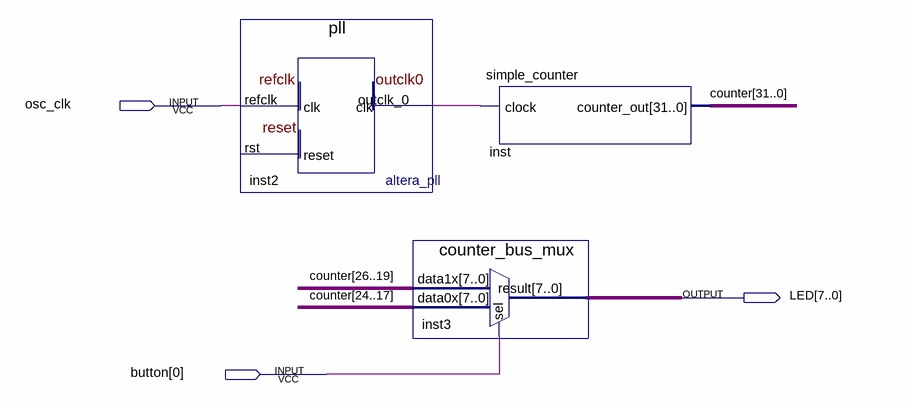
[diagram p0: schematic sheet]
// Quartus schematic my_first_fpga_top.bdf as structural Verilog: 3 symbols, 3 pins
module my_first_fpga_top (
  input  osc_clk,
  input  [0:0] button,
  output [7:0] LED
);

  wire inst2_outclk_0;
  wire [31:0] counter;

  pll inst2 (.refclk(osc_clk), .outclk_0(inst2_outclk_0));  // open: rst
  counter_bus_mux inst3 (.data1x(counter[26:19]), .data0x(counter[24:17]), .sel(button[0]), .result(LED));
  simple_counter inst (.clock(inst2_outclk_0), .counter_out(counter));
endmodule
